# EAGLE design Servo board (EAGLE 9.7.0)
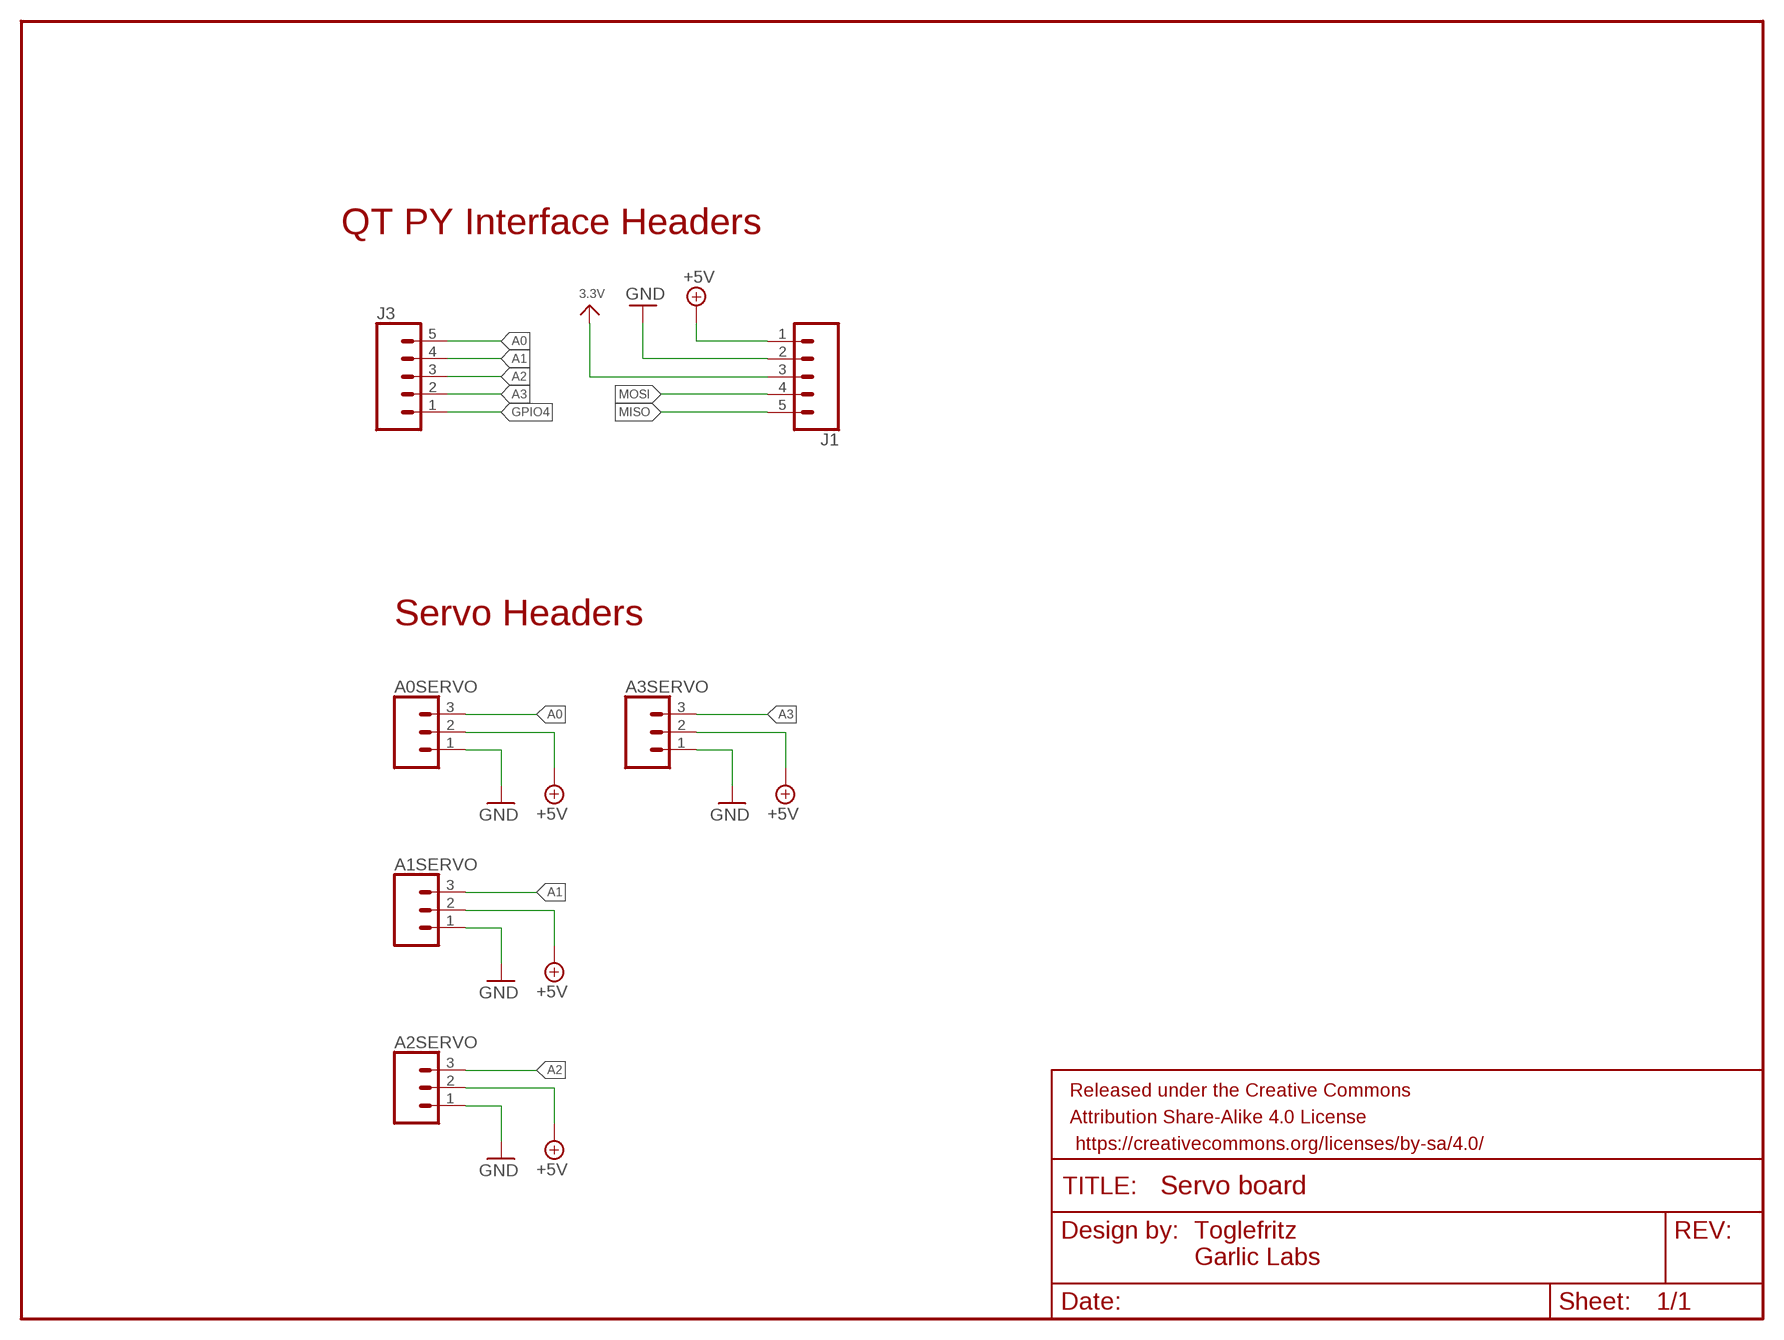
[diagram p0: schematic, sheet 1]

## Parts
A0SERVO  CONN_03  [1X03]
A1SERVO  CONN_03  [1X03]
A2SERVO  CONN_03  [1X03]
A3SERVO  CONN_03  [1X03]
FRAME1  FRAME-LETTERNO_PACKAGE  [DUMMY]
J1  CONN_05NO_SILK  [1X05_NO_SILK]
J3  CONN_05NO_SILK  [1X05_NO_SILK]

## Nets
3.3V: J1.3
+5V [power]: A0SERVO.2 A1SERVO.2 A2SERVO.2 A3SERVO.2 J1.1
A0: A0SERVO.3 J3.5
A1: A1SERVO.3 J3.4
A2: A2SERVO.3 J3.3
A3: A3SERVO.3 J3.2
GND [power]: A0SERVO.1 A1SERVO.1 A2SERVO.1 A3SERVO.1 J1.2
GPIO4: J3.1
MISO: J1.5
MOSI: J1.4

## Notes on the sheet
- QT PY Interface Headers
- Servo Headers
- Toglefritz
  Garlic Labs

## Library data of the parts
A0SERVO A1SERVO A2SERVO A3SERVO = Push-Fit_CONN:CONN_03: Multi connection point. Often used as Generic Header-pin footprint for 0.1 inch spaced/style header connections On any of the 0.1 inch spaced packages, you can populate with these: Break Away Headers - Straight <https://www.sparkfun.com/products/116> (PRT-00116) Break Away Male Headers - Right Angle <https://www.sparkfun.com/products/553> (PRT-00553) Female Headers <https://www.sparkfun.com/products/115> (PRT-00115) Break Away Headers - Machine Pin <https://www.sparkfun.com/products/117> (PRT-00117) Break Away Female Headers - Swiss Machine Pin <https://www.sparkfun.com/products/743> (PRT-00743) Stackable Header - 3 Pin (Female, 0.1") <https://www.sparkfun.com/products/13875> (PRT-13875) For SCREWTERMINALS and SPRING TERMINALS visit here: Screw Terimnals on SparkFun.com <https://www.sparkfun.com/search/results?term=Screw+Terminals> (5mm/3.5mm/2.54mm spacing) This device is also useful as a general connection point to wire up your design to another part of your project. Our various solder wires solder well into these plated through hole pads. Hook-Up Wire - Assortment (Stranded, 22 AWG) <https://www.sparkfun.com/products/11375> (PRT-11375) Hook-Up Wire - Assortment (Solid Core, 22 AWG) <https://www.sparkfun.com/products/11367> (PRT-11367) View the entire wire category on our website here <https://www.sparkfun.com/categories/141> Special notes: Molex polarized connector foot print use with SKU : PRT-08232 with associated crimp pins and housings.
FRAME1 = SparkFun-Aesthetics:FRAME-LETTER: Schematic Frame - Letter Standard 8.5x11 US Letter frame; DESIGNER: Nobody; VERSION: v01
J1 J3 = SparkFun-Connectors:CONN_05: Multi connection point. Often used as Generic Header-pin footprint for 0.1 inch spaced/style header connections On any of the 0.1 inch spaced packages, you can populate with these: Break Away Headers - Straight <https://www.sparkfun.com/products/116> (PRT-00116) Break Away Male Headers - Right Angle <https://www.sparkfun.com/products/553> (PRT-00553) Female Headers <https://www.sparkfun.com/products/115> (PRT-00115) Break Away Headers - Machine Pin <https://www.sparkfun.com/products/117> (PRT-00117) Break Away Female Headers - Swiss Machine Pin <https://www.sparkfun.com/products/743> (PRT-00743) For SCREWTERMINALS and SPRING TERMINALS visit here: Screw Terimnals on SparkFun.com <https://www.sparkfun.com/search/results?term=Screw+Terminals> (5mm/3.5mm/2.54mm spacing) This device is also useful as a general connection point to wire up your design to another part of your project. Our various solder wires solder well into these plated through hole pads. Hook-Up Wire - Assortment (Stranded, 22 AWG) <https://www.sparkfun.com/products/11375> (PRT-11375) Hook-Up Wire - Assortment (Solid Core, 22 AWG) <https://www.sparkfun.com/products/11367> (PRT-11367) View the entire wire category on our website here <https://www.sparkfun.com/categories/141> Special notes: Molex polarized connector foot print use with SKU : PRT-08231 with associated crimp pins and housings. 1MM SMD Version SKU: PRT-10208

## Net classes
1 power: width 0.508 mm
2 gnd: width 0.254 mm

## Board
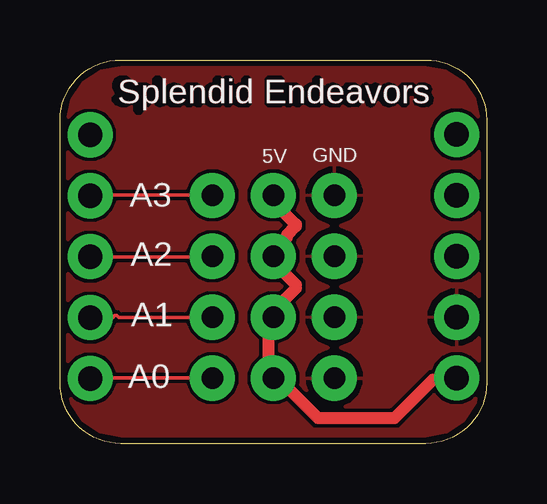
[diagram p1: board, top side]
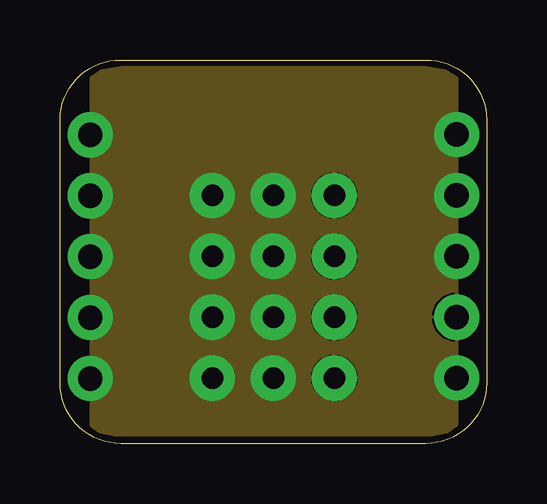
[diagram p2: board, inner layer Route2]
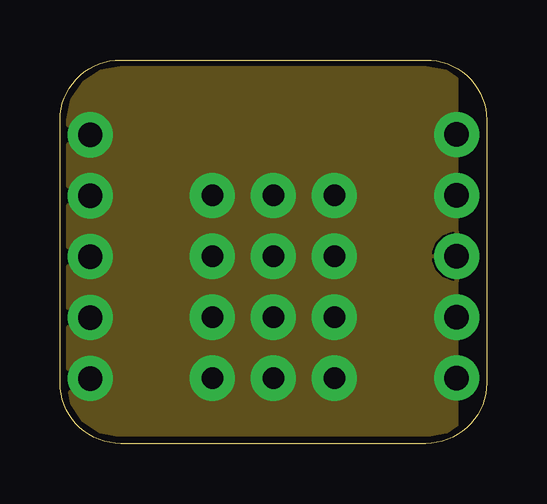
[diagram p3: board, inner layer Route15]
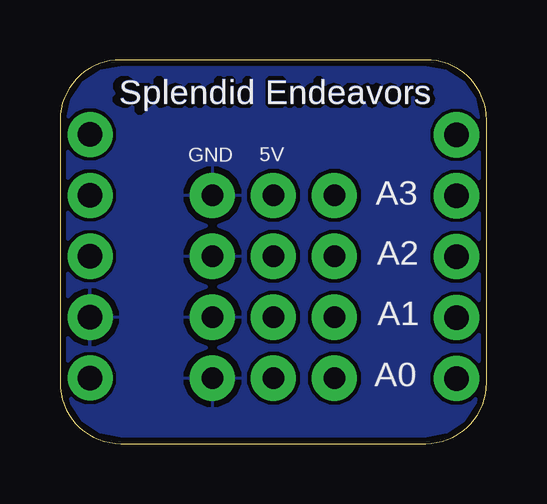
[diagram p4: board, bottom side, seen from below]

Size 17.78 x 16 mm. Coordinates in mm from the lower left corner, seen from the top.
Outline: 17.78,13.5 17.78,2.54 arc-90 15.24,0 2.54,0 arc-90 0,2.54 0,13.5 arc-90 2.54,16 15.24,16 arc-90 17.78,13.5
Copper layers (1*16): Top / Bottom
Stack-up 2 Layer Stack: Top SilkScreen Epoxy Ink / Top SolderMask SR:Green 0.0254mm Dk 4.3 / Top Surface Finish Lead-Free 0.02mm / Top CuFoil:007 0.035mm / Dielectric-1 Core:084 1.067mm / Bottom CuFoil:007 0.035mm / Bottom Surface Finish Lead-Free 0.02mm / Bottom SolderMask SR:Green 0.0254mm Dk 4.3 / Bottom SilkScreen Epoxy Ink
Design rules: minimum drill size 15.5mil, minimum copper width class=1 20mil, minimum copper width class=2 10mil, minimum copper width 6mil, keepout clearance 0mil, drill distance 8mil, dimension clearance 10mil, restrict clearance 0mil, copper clearance wire_polygon to wire_polygon 6mil, copper clearance wire_polygon to pad_smd 6mil, copper clearance wire_polygon to via 6mil, copper clearance pad_smd to pad_smd 6mil, copper clearance pad_smd to via 6mil, copper clearance via to via 6mil, copper clearance smd to pad (same net) 6mil, copper clearance smd to via (same net) 6mil, copper clearance smd to smd (same net) 6mil

### Footprints (pad centres in the part's own frame; a part is rotated, then mirrored left to right if it is on the bottom)
1X03 = drill 0.9 pad 1.88: 1 0,0; 2 2.54,0; 3 5.08,0
1X05_NO_SILK = drill 1.016 pad 1.88: 1 0,0; 2 2.54,0; 3 5.08,0; 4 7.62,0; 5 10.16,0

### Placement (x,y rotation side)
A0SERVO  11.43,2.73 180 top
A1SERVO  11.43,5.27 180 top
A2SERVO  11.43,7.81 180 top
A3SERVO  11.43,10.35 180 top
FRAME1  -6.53,-4.76 0 top  (outside the outline)
J1  16.52,2.73 90 top
J3  1.26,12.88 270 top

### Tracks (layer width: path | path; a pad name or v marks a point on that pad's centre or on a via)
3.3V
  pour Route15: 16.6,16 -0.08,16 -0.08,0.29 16.6,0.29
+5V
  Top 0.508: J1.1 16.46,2.67 15.54,2.67 13.95,1.07 10.74,1.07 9.07,2.74 A0SERVO.2 8.84,2.74 8.84,3.43 8.69,3.58 8.69,4.42 8.84,4.57 8.84,5.26 A1SERVO.2 8.84,5.49 9.83,6.48 9.83,6.63 8.91,7.54 8.91,7.77 A2SERVO.2 9.07,8 9.07,8.23 9.45,8.61 9.45,8.69 9.83,9.07 9.83,9.14 8.91,10.06 8.91,10.29 A3SERVO.2
A0
  Top 0.152: J3.5 1.29,2.74 6.33,2.74 A0SERVO.3
A1
  Top 0.152: J3.4 1.29,5.26 2.21,5.26 2.29,5.33 2.36,5.33 2.44,5.26 6.33,5.26 A1SERVO.3
A2
  Top 0.152: J3.3 1.29,7.77 6.33,7.77 A2SERVO.3
A3
  Top 0.152: J3.2 1.29,10.36 6.33,10.36 A3SERVO.3
GND
  pour Route2: 16.59,16 1.25,16 1.25,0.3 16.59,0.3
  pour Bottom: 0,13.5 0,2.54 arc90 2.54,0 15.24,0 arc90 17.78,2.54 17.78,13.5 arc90 15.24,16 2.54,16 arc90
  pour Top: 0,13.5 0,2.54 arc90 2.54,0 15.24,0 arc90 17.78,2.54 17.78,13.5 arc90 15.24,16 2.54,16 arc90

### Text on the board
Top: Splendid Endeavors
Bottom: Splendid Endeavors
tPlace: Splendid Endeavors | 5V | GND | A3 | A2 | A1 | A0
bPlace: Splendid Endeavors | 5V | GND | A3 | A2 | A1 | A0